# EAGLE design vssb_SMD (EAGLE 6.4)
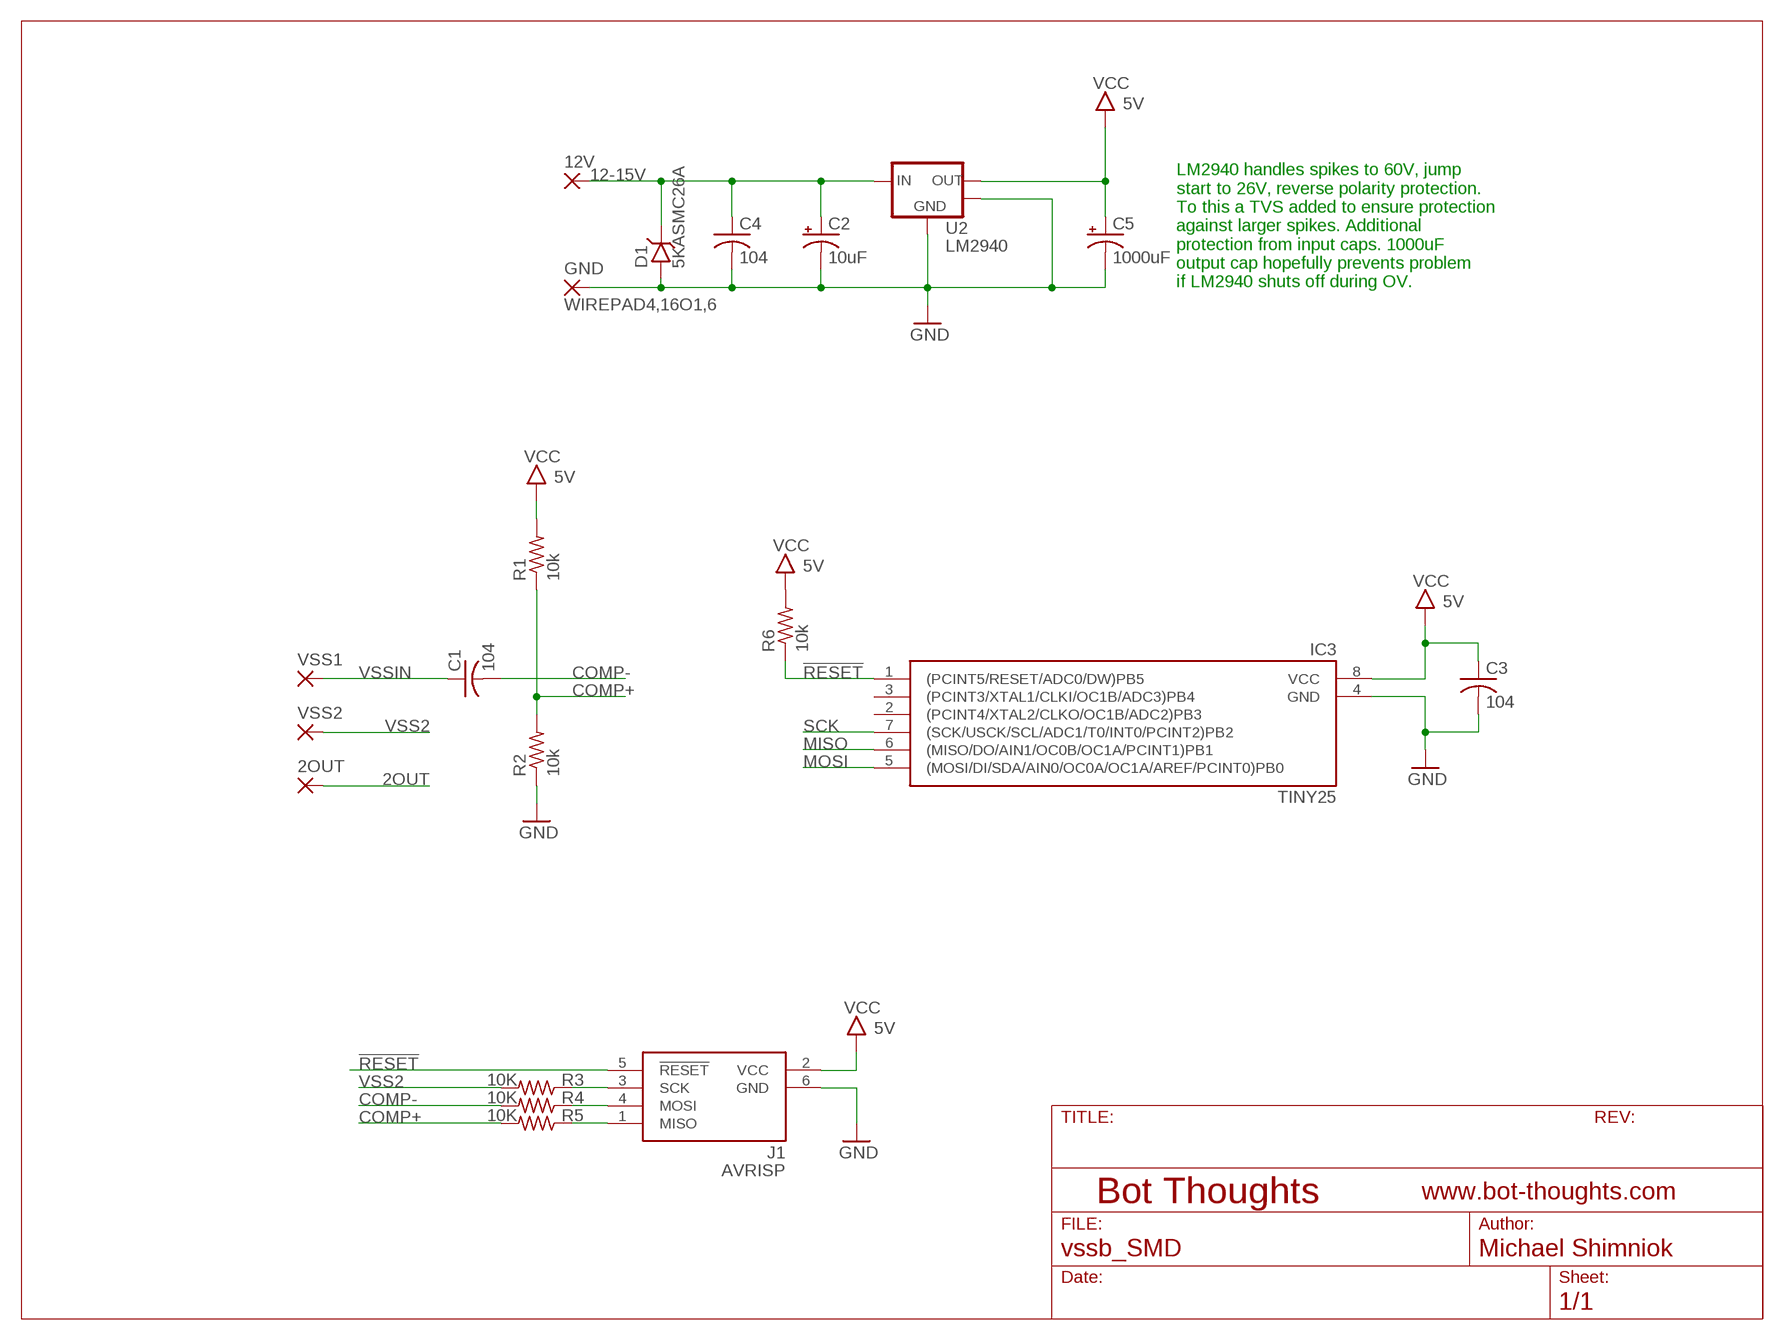
[diagram p0: schematic, sheet 1]

## Parts
2OUT  WIREPAD4,16O1,6  [4,16O1,6]
12V  WIREPAD4,16O1,6  [4,16O1,6]
C1  104  C-USC0603  [C0603]
C2  10uF  CPOL-USE2.5-6  [E2,5-6]
C3  104  C-USC0603  [C0603]
C4  104  C-USC0603  [C0603]
C5  1000uF  CPOL-USE5-13  [E5-13]
D1  5KASMC26A  5KASMC  [DO-214AB]
GND  WIREPAD4,16O1,6  [4,16O1,6]
IC3  TINY25  TINY25/45/85-20SSU  [SOIC8N]
J1  AVRISP  AVRISP6_COMPACT  [CON6P2R]
R1  10k  R-US_R0603  [R0603]
R2  10k  R-US_R0603  [R0603]
R3  10K  R-US_R0603  [R0603]
R4  10K  R-US_R0603  [R0603]
R5  10K  R-US_R0603  [R0603]
R6  10k  R-US_R0603  [R0603]
U2  LM2940  LM2940DCY  [SOT-223-3]
VSS1  WIREPAD4,16O1,6  [4,16O1,6]
VSS2  WIREPAD4,16O1,6  [4,16O1,6]

## Nets
2OUT: 2OUT.1(P)
12-15V: 12V.1(P) C2.+ C4.1 D1.C U2.1(VIN)
!RESET: IC3.1((PCINT5/RESET/ADC0/DW)PB5) J1.5(!RESET) R6.1
COMP+: R1.1 R2.2 R5.2
COMP-: C1.2 R4.2
GND: C2.- C3.2 C4.2 C5.- D1.A GND.1(P) IC3.4(GND) J1.6(GND) R2.1 U2.2(GND) U2.4(TAB)
MISO: IC3.6((MISO/DO/AIN1/OC0B/OC1A/PCINT1)PB1) J1.1(MISO) R5.1
MOSI: IC3.5((MOSI/DI/SDA/AIN0/OC0A/OC1A/AREF/PCINT0)PB0) J1.4(MOSI) R4.1
SCK: IC3.7((SCK/USCK/SCL/ADC1/T0/INT0/PCINT2)PB2) J1.3(SCK) R3.1
VCC: C3.1 C5.+ IC3.8(VCC) J1.2(VCC) R1.2 R6.2 U2.3(VOUT) ; supply symbol labelled 5V
VSS2: R3.2 VSS2.1(P)
VSSIN: C1.1 VSS1.1(P)
Unconnected: IC3.2((PCINT4/XTAL2/CLKO/OC1B/ADC2)PB3) IC3.3((PCINT3/XTAL1/CLKI/OC1B/ADC3)PB4)

## Notes on the sheet
- LM2940 handles spikes to 60V, jump
  start to 26V, reverse polarity protection.
  To this a TVS added to ensure protection
  against larger spikes. Additional
  protection from input caps. 1000uF
  output cap hopefully prevents problem
  if LM2940 shuts off during OV.

## Library data of the parts
2OUT 12V GND VSS1 VSS2 = wirepad:WIREPAD: Wire PAD connect wire on PCB
C1 C3 C4 = rcl:C-US: CAPACITOR, American symbol
C2 C5 = rcl:CPOL-US: POLARIZED CAPACITOR, American symbol
D1 = bt_diode:5KASMC: 5KASMC TVS Diode Surface mount PAR® Transient Voltage Suppressors with high temperature stability and high reliability conditions. Junction passivation optimized design passivated anisotropic rectifier technology. TJ = 185 °C capability suitable for high reliability and automotive requirement. AEC-Q101 qualified. PPPM=5000W Vishay General Semiconductor datasheet.pdf <http://www.vishay.com/docs/89432/5kasmc.pdf>
IC3 = bt_avr:TINY25/45/85: Atmel AVR ATiny25,45,85 8-bit Microcontroller
J1 = bt_avr:AVRISP6: 6-pin dual-row connector for Atmel AVRISP programmer interface
R1-R6 = rcl:R-US_: RESISTOR, American symbol
U2 = bt_regulator:LM2940: LM2940 LDO Voltage Regulator The LM2940-N/LM2940C positive voltage regulator features the ability to source 1A of output current with a dropout voltage of typically 0.5V and a maximum of 1V over the entire temperature range. Furthermore, a quiescent current reduction circuit has been included which reduces the ground current when the differential between the input voltage and the output exceeds approximately 3V. Designed also for vehicular applications, the LM2940-N/LM2940C and all regulated circuitry are protected from reverse battery installations or 2-battery jumps. During line transients, such as load dump when the input voltage can momentarily exceed the specified maximum operating voltage, the regulator will automatically shut down to protect both the internal circuits and the load. The LM2940/LM2940C cannot be harmed by temporary mirror-image insertion. Familiar regulator features such as short circuit and thermal overload protection are also provided. Datasheet.pdf <http://www.ti.com/lit/ds/symlink/lm2940-n.pdf>

## Board
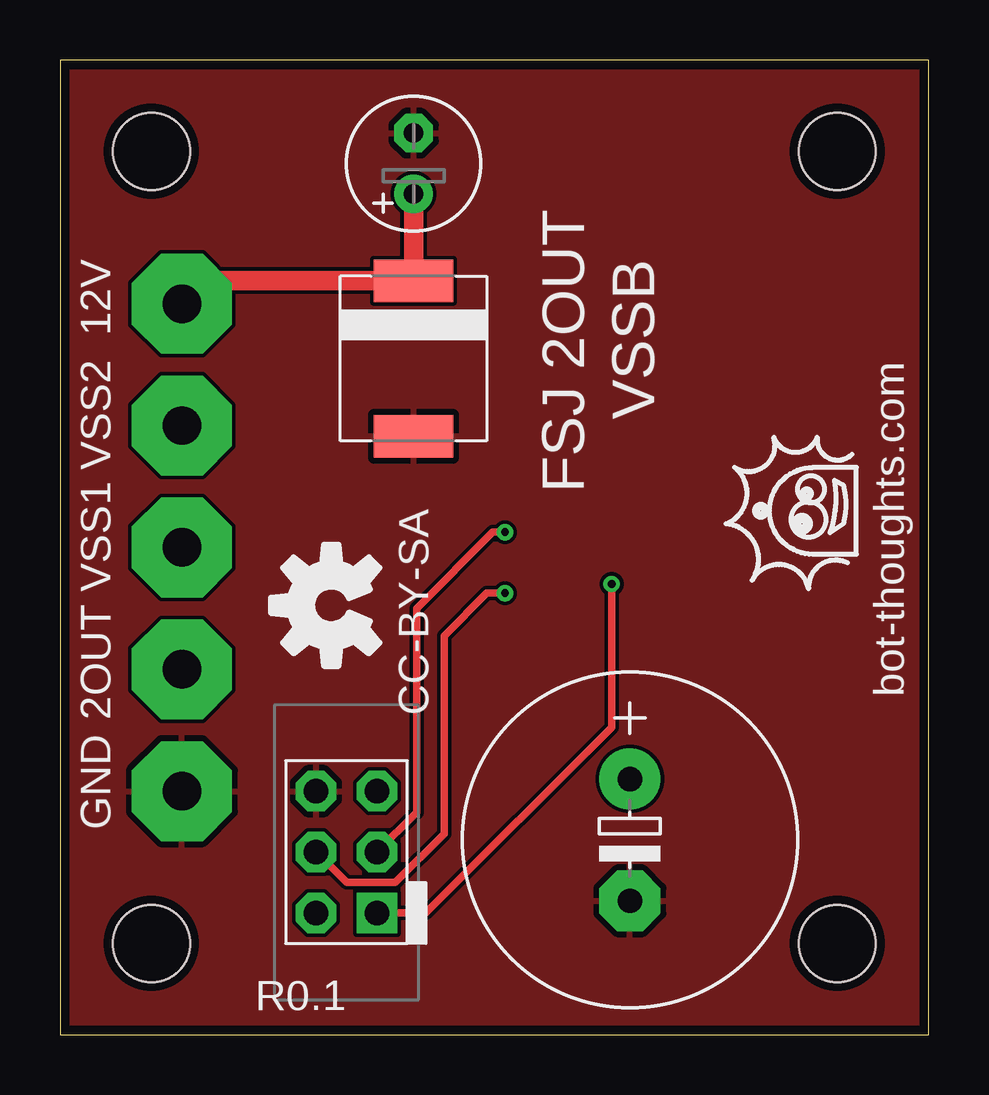
[diagram p1: board, top side]
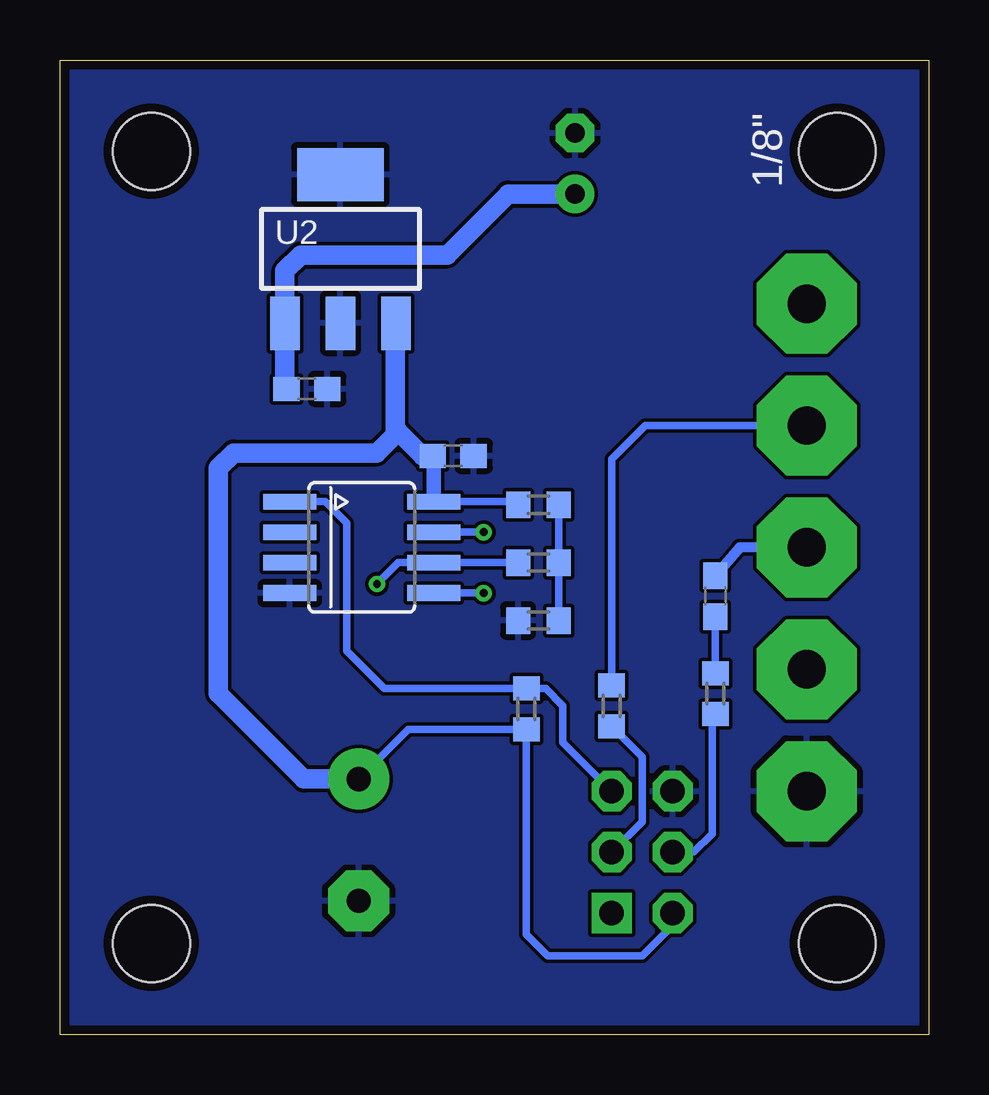
[diagram p2: board, bottom side, seen from below]

Size 36.2 x 40.64 mm. Coordinates in mm from the lower left corner, seen from the top.
Outline: 0,0 36.2,0 36.2,40.64 0,40.64 0,0
Copper layers (1*16): Top 0.0356mm / dielectric 1.5011mm / Bottom 0.0356mm
Design rules "LaenPCBOrder": minimum track width 6mil, minimum drill 13mil, track to track 6mil, track to pad 6mil, pad to pad 6mil, via to via 6mil, smd to smd 6mil, copper to edge 15mil, drill to drill 6mil, minimum pad ring 7mil, minimum via ring 7mil, stop-mask expansion 3mil, vias tented up to drill 20mil, thermal gap 10mil
Holes 3.2 mm at 3.81,36.83 32.38,36.83 32.38,3.81 3.81,3.81

### Footprints (pad centres in the part's own frame; a part is rotated, then mirrored left to right if it is on the bottom)
4,16O1,6 = drill 1.6 pad 4.166 octagon: 1 0,0
C0603 = smd 1.1 x 1: 1 -0.85,0; 2 0.85,0
E2,5-6 = drill 0.813 pad 1.6: + -1.27,0 | drill 0.813 pad 1.6 octagon: - 1.27,0
E5-13 = drill 1.016 pad 2.54: + -2.54,0 | drill 1.016 pad 2.54 octagon: - 2.54,0
DO-214AB = smd 1.778 x 3.302: A 3.239,0; C -3.239,0
SOIC8N = smd 0.66 x 2.2: 1 -1.905,-3; 2 -0.635,-3; 3 0.635,-3; 4 1.905,-3; 5 1.905,3; 6 0.635,3; 7 -0.635,3; 8 -1.905,3
CON6P2R = drill 1.016 pad 1.676 square: 1 -2.54,-1.27 | drill 1.016 pad 1.676 octagon: 2 -2.54,1.27; 3 0,-1.27; 4 0,1.27; 5 2.54,-1.27; 6 2.54,1.27
R0603 = smd 1 x 1.1: 1 -0.85,0; 2 0.85,0
SOT-223-3 = smd 1.219 x 2.235: 1 -2.311,-3.099; 2 0,-3.099; 3 2.311,-3.099 | smd 3.6 x 2.2: 4 0,3.099

### Placement (x,y rotation side)
2OUT  5.08,15.24 90 top
12V  5.08,30.48 90 top
C1  8.89,18.29 270 bottom
C2  14.73,36.32 90 top
C3  19.81,24.13 0 bottom
C4  25.91,26.92 0 bottom
C5  23.75,8.13 270 top
D1  14.73,28.19 270 top
GND  5.08,10.16 90 top
IC3  23.62,20.32 270 bottom
J1  11.94,7.62 90 top
R1  16.26,22.1 180 bottom
R2  16.26,17.27 0 bottom
R3  13.21,13.72 90 bottom
R4  8.89,14.22 90 bottom
R5  16.26,19.68 0 bottom
R6  16.76,13.59 270 bottom
U2  24.51,32.77 0 bottom
VSS1  5.08,20.32 90 top
VSS2  5.08,25.4 90 top

### Tracks (layer width: path | path; a pad name or v marks a point on that pad's centre or on a via)
12-15V
  Top 0.813: 12V.1 6.03,31.43 D1.C C2.+
  Bottom 0.813: C2.+ 17.53,35.05 20.07,32.51 26.16,32.51 26.82,31.85 U2.1 26.82,26.99 C4.1
!RESET
  Bottom 0.305: J1.5 15.24,12.19 15.24,13.72 15.96,14.44 R6.1 22.69,14.44 24.26,16 24.26,21.34 25.15,22.23 IC3.1
COMP+
  Bottom 0.305: R2.2 R5.2 R1.1
COMP-
  Bottom 0.305: R4.2 C1.2
GND
  pour Bottom: 0,0 0,40.64 36.2,40.64 36.2,0
  pour Top: 0,40.64 36.2,40.64 36.2,0 0,0
MISO  (via drill 0.33)
  Top 0.305: J1.1 15.24,5.08 22.99,12.83 v22.99,18.8
  Bottom 0.305: R5.1 IC3.6 22.1,19.68 v22.99,18.8
MOSI  (via drill 0.33)
  Top 0.305: v18.54,18.41 17.78,18.41 16,16.64 16,8.38 13.97,6.35 11.94,6.35 J1.4
  Bottom 0.305: J1.4 9.78,7.62 9.02,8.38 9.02,13.25 R4.1 | IC3.5 v18.54,18.41
SCK  (via drill 0.33)
  Top 0.305: v18.54,20.95 18.03,20.95 14.86,17.78 14.86,9.27 J1.3
  Bottom 0.305: J1.3 11.94,8.89 11.94,11.6 R3.1 | IC3.7 v18.54,20.95
VCC
  Bottom 0.305: IC3.8 17.23,22.23 R1.2 | J1.2 10.67,4.57 11.94,3.3 15.88,3.3 16.76,4.19 R6.2 21.68,12.74 C5.+
  Bottom 0.61: IC3.8 20.62,24.01 C3.1
  Bottom 0.813: C3.1 21.08,24.13 22.1,25.15 | 22.1,25.15 22.23,25.27 22.23,29.64 U2.3 | C5.+ 26.04,10.67 29.59,14.22 29.59,23.62 28.96,24.26 22.99,24.26 22.1,25.15
VSS2
  Bottom 0.305: VSS2.1 11.81,25.4 13.21,24 R3.2
VSSIN
  Bottom 0.406: VSS1.1 7.87,20.32 C1.1

### Text on the board
tPlace: VSSB | CC-BY-SA | R0.1
bPlace: 1/8"
tNames: FSJ 2OUT | bot-thoughts.com